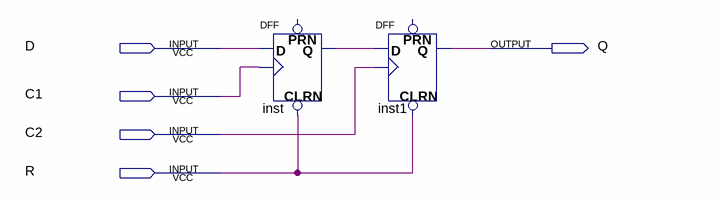
[diagram p0: schematic sheet]
// Quartus schematic point3.bdf as structural Verilog: 2 symbols, 5 pins
module point3 (
  input  D,
  input  C1,
  input  C2,
  input  R,
  output Q
);

  wire inst_q;

  DFF inst (.CLRN(R), .CLK(C1), .D(D), .Q(inst_q));  // open: PRN
  DFF inst1 (.CLRN(R), .CLK(C2), .D(inst_q), .Q(Q));  // open: PRN
endmodule
